# Altium schematic sheet Microcontroller.SchDoc
size A3; SheetNumber: 4; SheetTotal: 5
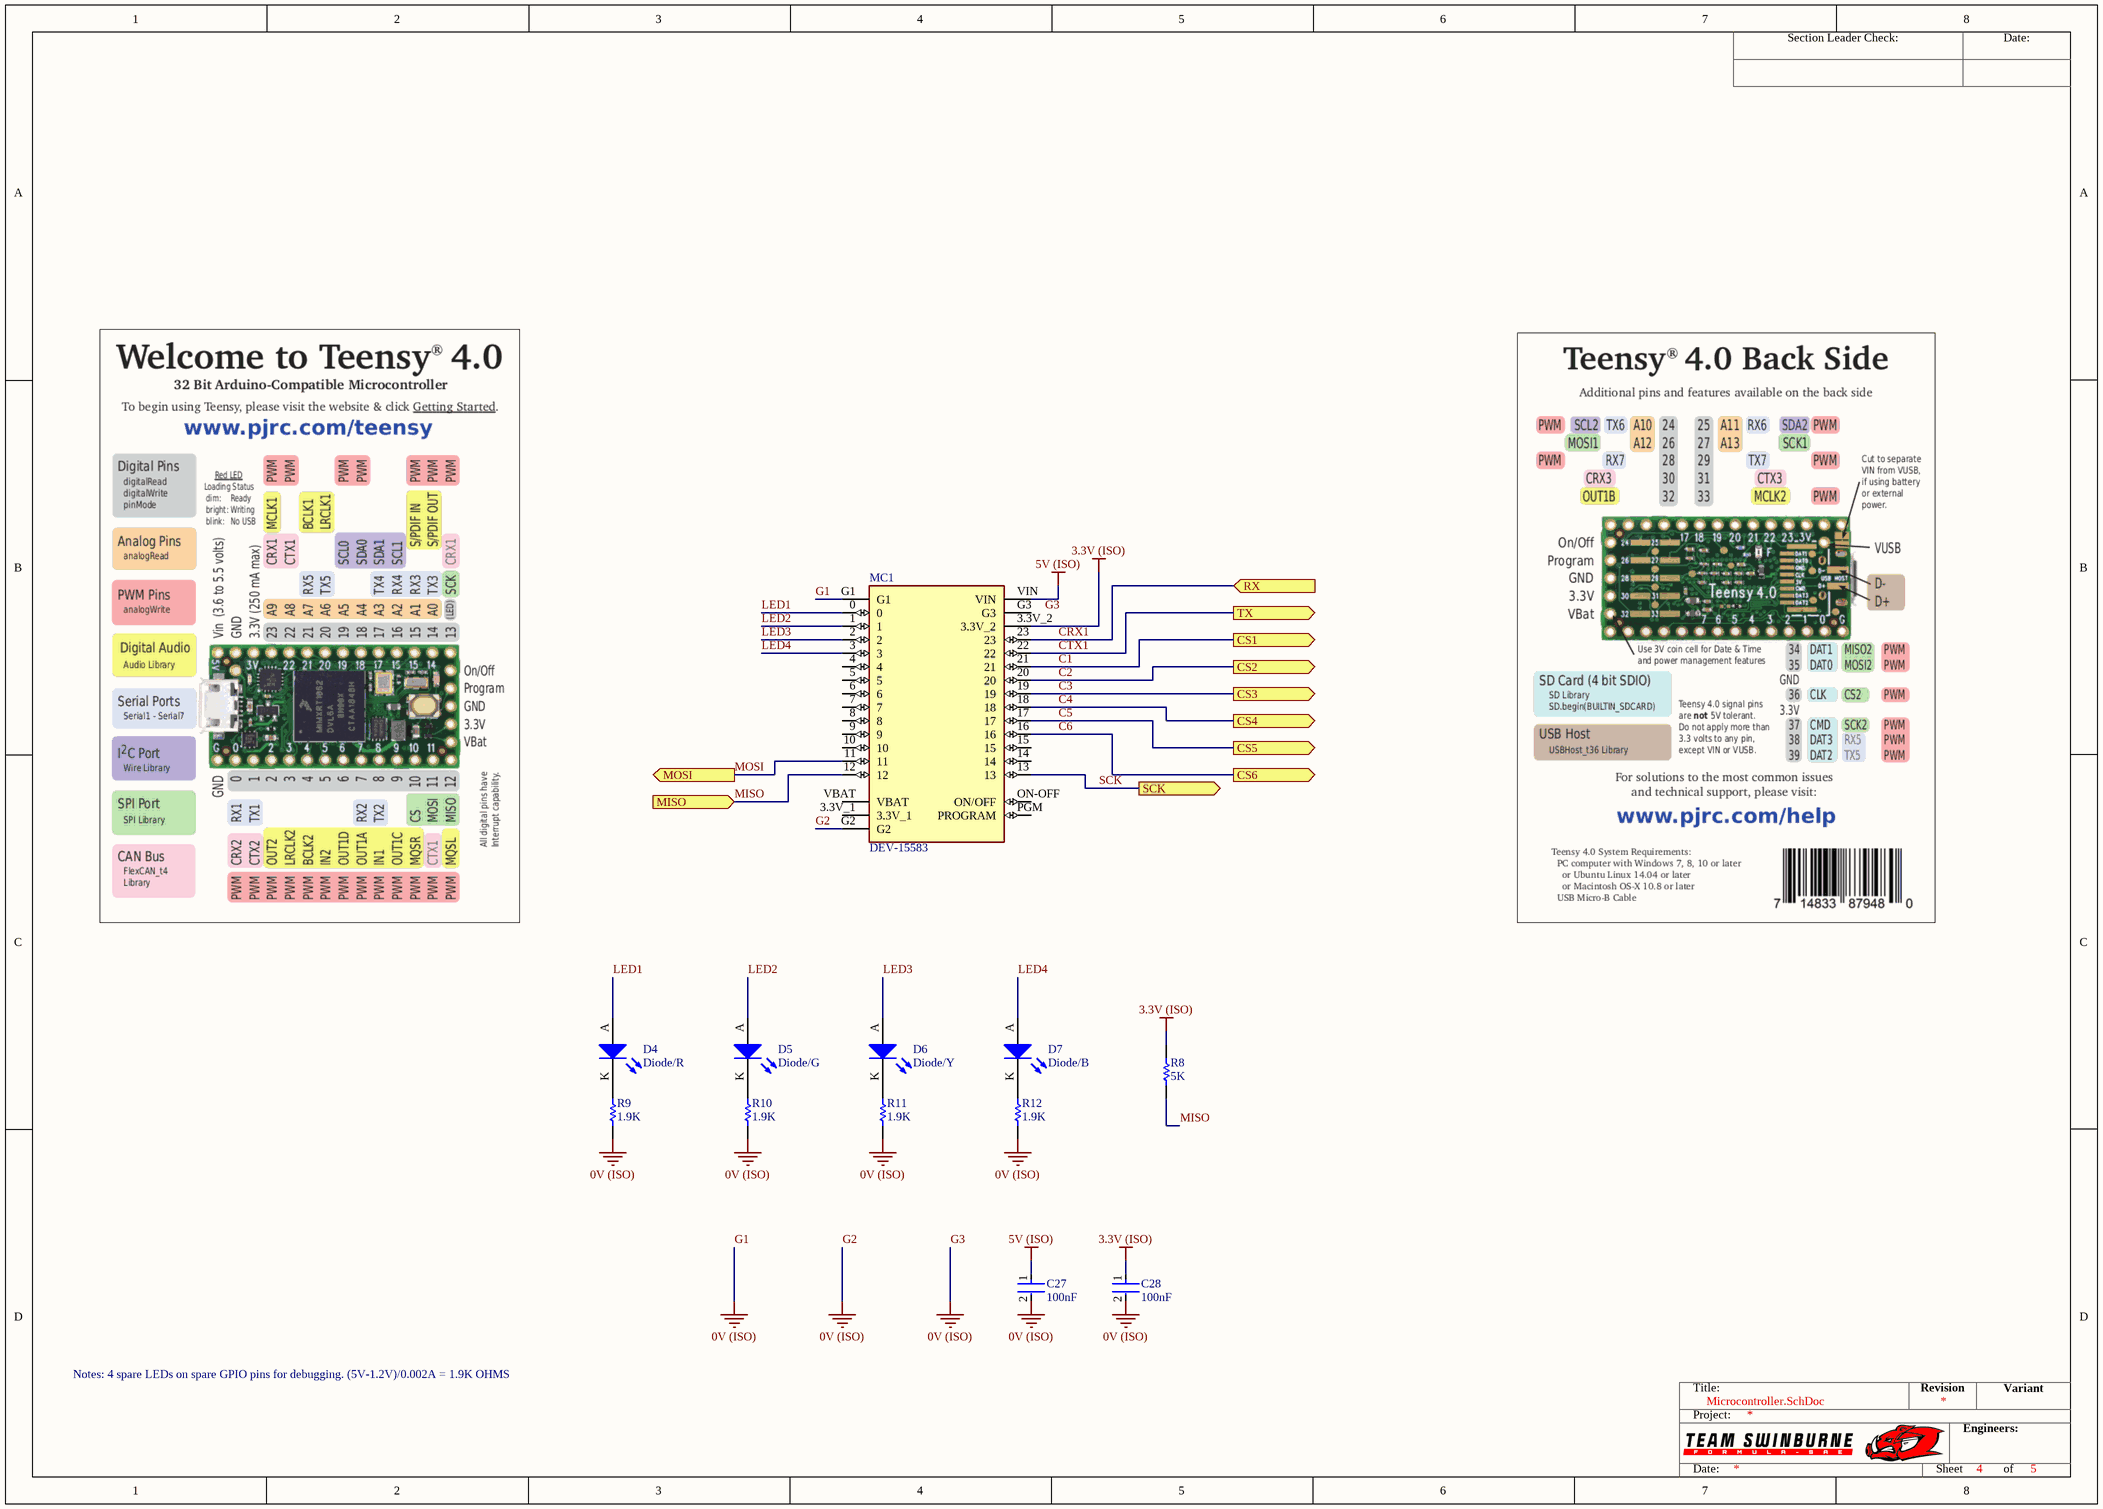
[diagram p0: Microcontroller.SchDoc]

## Parts
C27  100nF  [FP-GCM319-0_15-IPC_A]
C28  100nF  [FP-GCM319-0_15-IPC_A]
D4  Diode/R  [0805 LED]
D5  Diode/G  [0805 LED]
D6  Diode/Y  [0805 LED]
D7  Diode/B  [0805 LED]
MC1  DEV-15583  [DEV-15583-Footprint-1]
R8  5K  [Y16295K00000T9R-Footprint-1]
R9  1.9K  [Y16241K90000T9R-Footprint-1]
R10  1.9K  [Y16241K90000T9R-Footprint-1]
R11  1.9K  [Y16241K90000T9R-Footprint-1]
R12  1.9K  [Y16241K90000T9R-Footprint-1]

## Ports
CS1 (out), CS2 (out), CS3 (out), CS4 (out), CS5 (out), CS6 (out), MISO (in), MOSI (out), RX (in), SCK (out), TX (out)

## Nets
3.3V (ISO): C28.1 MC1.3.3V_2 R8.2
5V (ISO): C27.1 MC1.VIN
G1: C27.2 C28.2 MC1.G1 MC1.G2 R9.1 R10.1 R11.1 R12.1  [also labelled 0V (ISO), G2, G3]
C1: MC1.21 ; port CS1
C2: MC1.20 ; port CS2
C3: MC1.19 ; port CS3
C4: MC1.18 ; port CS4
C5: MC1.17 ; port CS5
C6: MC1.16 ; port CS6
CRX1: MC1.23 ; port RX
CTX1: MC1.22 ; port TX
LED1: D4.A MC1.0
LED2: D5.A MC1.1
LED3: D6.A MC1.2
LED4: D7.A MC1.3
MISO: MC1.12 R8.1 ; port MISO
MOSI: MC1.11 ; port MOSI
SCK: MC1.13 ; port SCK
NetD4_K: D4.K R9.2
NetD5_K: D5.K R10.2
NetD6_K: D6.K R11.2
NetD7_K: D7.K R12.2

Not connected (* = marked no-connect by the designer): MC1 3.3V_1 4 5 6 7 8 9 10 14 15 G3 ON-OFF(ON/OFF) PGM(PROGRAM) VBAT

## Notes on the sheet
- Notes: 4 spare LEDs on spare GPIO pins for debugging. (5V-1.2V)/0.002A = 1.9K OHMS
- Labels drawn without touching a wire or pin: G3
- Section Leader Check:
- Date:
- Title:
- Revision
- Variant
- Project:
- Engineers:
- Sheet
- of

## Library data of the parts
C27 C28 = CMP-CAP-0013-1: CAP CER 10000PF 100V NP0 1206; Dielectric: C0G; Tolerance: 5%; Capacitance: 10nF; Width: 0.063inch; Max Operating Temperature: 125°C; Construction: Flat; Termination: SMD/SMT; RoHS Compliant: Yes; Voltage Rating: 100V; Radiation Hardening: No; Ratings: AEC-Q200; Package Quantity: 1; Case/Package: 1206; Voltage Rating (DC): 100V; Case Code (Metric): 3216; Case Code (Imperial): 1206; Packaging: Tape and Reel; Depth: 1.6mm; Min Operating Temperature: -55°C; Lead Free: Lead Free; Thickness: 0.037inch; Mount: Surface Mount; Height: 0.85mm; Length: 3.2mm; Series: GCM
D4 = CMP-025-000006-1: Red LED Indication - Discrete 1.75V 0805 (2012 Metric); Part Number: SML-210LTT86
D5 = CMP-025-000003-1: Green LED Indication - Discrete 1.75V 0805 (2012 Metric); Part Number: SML-210FTT86
D6 = CMP-025-000005-1: Yellow LED Indication - Discrete 1.75V 0805 (2012 Metric); Part Number: SML-211YTT86
D7 = CMP-025-000007-1: LED BLUE CLEAR 2012 SMD; Part Number: SML-MN2BCTT86C
MC1 = CMP-029-000001-2: Teensy 4.0 Microcontroller Board
R8 = CMP-RES-0160-1: RED SMD 5K OHM 1/10W 0805
R9-R12 = CMP-RES-0159-1: RES SMD 1.9K OHM 1/5W 0805; Resistance: 1.9kR; Max Power Dissipation: 200mW; Tolerance: 0.01%; Temperature Coefficient: 0.2ppm/°C; Series: VSMP; Features: Moisture Resistant; Case Code (Metric): 2012; Package Quantity: 1000; Length: 0.08inch; Number of Terminations: 2; Height: 0.025inch; Resistor Type: Metal Foil; Min Operating Temperature: -55°C; Width: 0.05inch; RoHS Compliant: Yes; Max Operating Temperature: 150°C; Case Code (Imperial): 0805; Case/Package: 0805; Packaging: Tape and Reel